# EAGLE design AK4493_Breakout_2 (EAGLE 9.6.2)
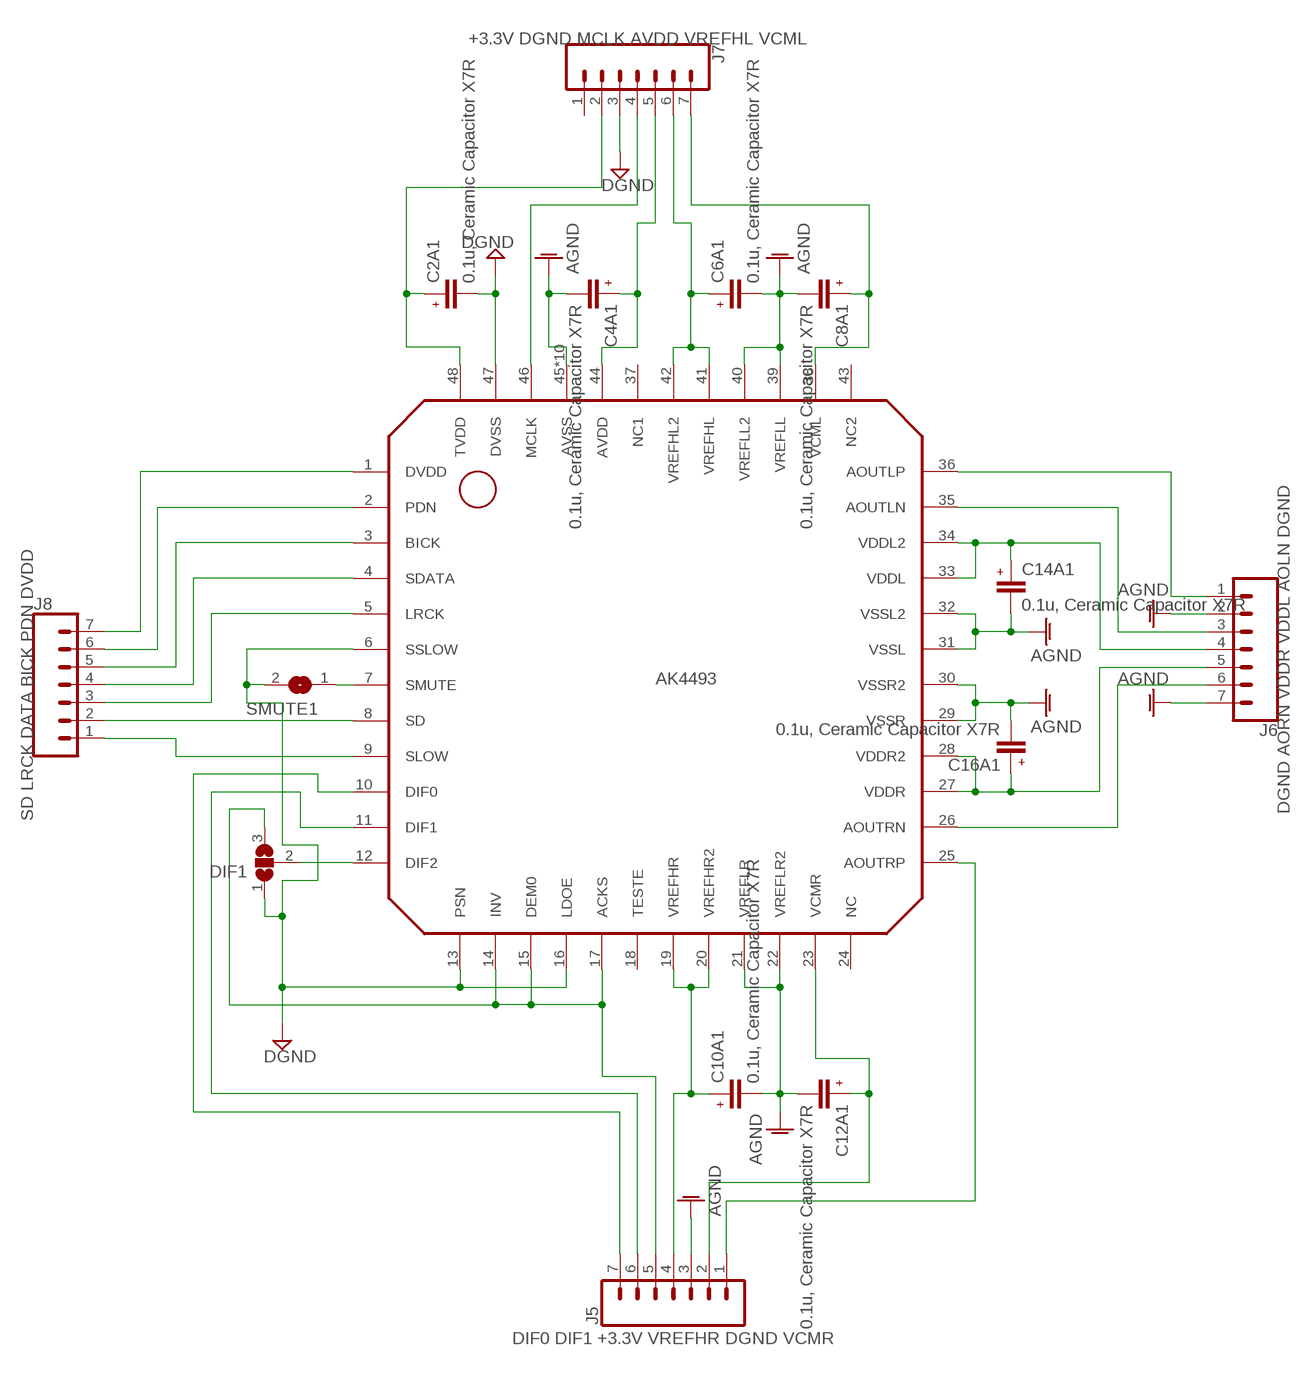
[diagram p0: schematic, sheet 1]

## Parts
C2A1  0.1u, Ceramic Capacitor X7R  C-POL-MLCCC0603K  [C0603K]
C4A1  0.1u, Ceramic Capacitor X7R  C-POL-MLCCC0603K  [C0603K]
C6A1  0.1u, Ceramic Capacitor X7R  C-POL-MLCCC0603K  [C0603K]
C8A1  0.1u, Ceramic Capacitor X7R  C-POL-MLCCC0603K  [C0603K]
C10A1  0.1u, Ceramic Capacitor X7R  C-POL-MLCCC0603K  [C0603K]
C12A1  0.1u, Ceramic Capacitor X7R  C-POL-MLCCC0603K  [C0603K]
C14A1  0.1u, Ceramic Capacitor X7R  C-POL-MLCCC0603K  [C0603K]
C16A1  0.1u, Ceramic Capacitor X7R  C-POL-MLCCC0603K  [C0603K]
DIF1  SJ2W  [SJ_2]
IC2  AK4493  [LQFP48_]
J5  CONN_07  [1X07]
J6  CONN_07  [1X07]
J7  CONN_07  [1X07]
J8  CONN_07  [1X07]
SMUTE1  SJ  [SJ]

## Nets
AGND: C4A1.2 C4A1.3 C6A1.2 C6A1.3 C8A1.2 C8A1.3 C10A1.2 C10A1.3 C12A1.2 C12A1.3 C14A1.2 C14A1.3 C16A1.2 C16A1.3 IC2.21(VREFLR) IC2.22(VREFLR2) IC2.29(VSSR) IC2.30(VSSR2) IC2.31(VSSL) IC2.32(VSSL2) IC2.39(VREFLL) IC2.40(VREFLL2) IC2.45(AVSS) IC2.P$1(AVSS) IC2.P$2(AVSS) IC2.P$4(AVSS) IC2.P$6(AVSS) IC2.P$8(AVSS) IC2.P$10(AVSS) IC2.P$17(AVSS) IC2.P$18(AVSS) IC2.P$25(AVSS) J5.3 J6.2 J6.7
DGND: C2A1.2 C2A1.3 DIF1.1 IC2.6(SSLOW) IC2.13(PSN) IC2.16(LDOE) IC2.47(DVSS) J7.3 SMUTE1.2
N$24 [L_Audio]: IC2.36(AOUTLP) J6.1
N$27 [L_Audio]: IC2.35(AOUTLN) J6.3
N$28 [R_Audio]: IC2.25(AOUTRP) J5.1
N$29 [R_Audio]: IC2.26(AOUTRN) J6.6
N$30: IC2.9(SLOW) J8.1
N$31: IC2.10(DIF0) J5.7
N$32: IC2.5(LRCK) J8.3
N$33: IC2.4(SDATA) J8.4
N$34: IC2.3(BICK) J8.5
N$35: IC2.46(MCLK) J7.4
N$36: IC2.1(DVDD) J8.7
N$37: C4A1.1 IC2.44(AVDD) J7.5
N$38: IC2.2(PDN) J8.6
N$39: C8A1.1 IC2.38(VCML) J7.7
N$40: C12A1.1 IC2.23(VCMR) J5.2
N$41: C6A1.1 IC2.41(VREFHL) IC2.42(VREFHL2) J7.6
N$42: DIF1.2 IC2.12(DIF2)
N$43: IC2.7(SMUTE) SMUTE1.1
N$44: IC2.8(SD) J8.2
N$45: IC2.11(DIF1) J5.6
N$46: C10A1.1 IC2.19(VREFHR) IC2.20(VREFHR2) J5.4
N$47: C14A1.1 IC2.33(VDDL) IC2.34(VDDL2) J6.4
N$48: C16A1.1 IC2.27(VDDR) IC2.28(VDDR2) J6.5
N$49: C2A1.1 IC2.48(TVDD) J7.2
N$50: DIF1.3 IC2.14(INV) IC2.15(DEM0) IC2.17(ACKS) J5.5
Unconnected: IC2.18(TESTE) IC2.24(NC) IC2.37(NC1) IC2.43(NC2) J7.1

## Notes on the sheet
- +3.3V DGND MCLK AVDD VREFHL VCML
- DGND AORN VDDR VDDL AOLN DGND
- SD LRCK DATA BICK PDN DVDD
- DIF0 DIF1 +3.3V VREFHR DGND VCMR

## Library data of the parts
C2A1 C4A1 C6A1 C8A1 C10A1 C12A1 C14A1 C16A1 = Dual Mono Amp Library:C-POL-MLCC: CAPACITOR, European symbol; SPICEPREFIX: C
DIF1 = Dual Mono Amp Library:SJ2W: SMD solder JUMPER
IC2 = Dual Mono Amp Library:AK4493: Quality Oriented 32-Bit 2ch DAC 32-Bit, 768 kHz with VELVET SOUND
J5-J8 = Dual Mono Amp Library:CONN_07: Multi connection point. Often used as Generic Header-pin footprint for 0.1 inch spaced/style header connections On any of the 0.1 inch spaced packages, you can populate with these: Break Away Headers - Straight <https://www.sparkfun.com/products/116> (PRT-00116) Break Away Male Headers - Right Angle <https://www.sparkfun.com/products/553> (PRT-00553) Female Headers <https://www.sparkfun.com/products/115> (PRT-00115) Break Away Headers - Machine Pin <https://www.sparkfun.com/products/117> (PRT-00117) Break Away Female Headers - Swiss Machine Pin <https://www.sparkfun.com/products/743> (PRT-00743) For SCREWTERMINALS and SPRING TERMINALS visit here: Screw Terimnals on SparkFun.com <https://www.sparkfun.com/search/results?term=Screw+Terminals> (5mm/3.5mm/2.54mm spacing) This device is also useful as a general connection point to wire up your design to another part of your project. Our various solder wires solder well into these plated through hole pads. Hook-Up Wire - Assortment (Stranded, 22 AWG) <https://www.sparkfun.com/products/11375> (PRT-11375) Hook-Up Wire - Assortment (Solid Core, 22 AWG) <https://www.sparkfun.com/products/11367> (PRT-11367) View the entire wire category on our website here <https://www.sparkfun.com/categories/141> Special notes: Molex polarized connector foot print use with SKU : PRT-08231 with associated crimp pins and housings. 1MM SMD Version SKU: PRT-10208 NOTES ON THE VARIANTS LOCK and LOCK_LONGPADS... This footprint was designed to help hold the alignment of a through-hole component (i.e. 6-pin header) while soldering it into place. You may notice that each hole has been shifted either up or down by 0.005 of an inch from it's more standard position (which is a perfectly straight line). This slight alteration caused the pins (the squares in the middle) to touch the edges of the holes. Because they are alternating, it causes a "brace" to hold the component in place. 0.005 has proven to be the perfect amount of "off-center" position when using our standard breakaway headers. Although looks a little odd when you look at the bare footprint, once you have a header in there, the alteration is very hard to notice. Also,if you push a header all the way into place, it is covered up entirely on the bottom side.; PROD_ID: Combine 8288+14485
SMUTE1 = Dual Mono Amp Library:SJ: SMD solder JUMPER

## Board
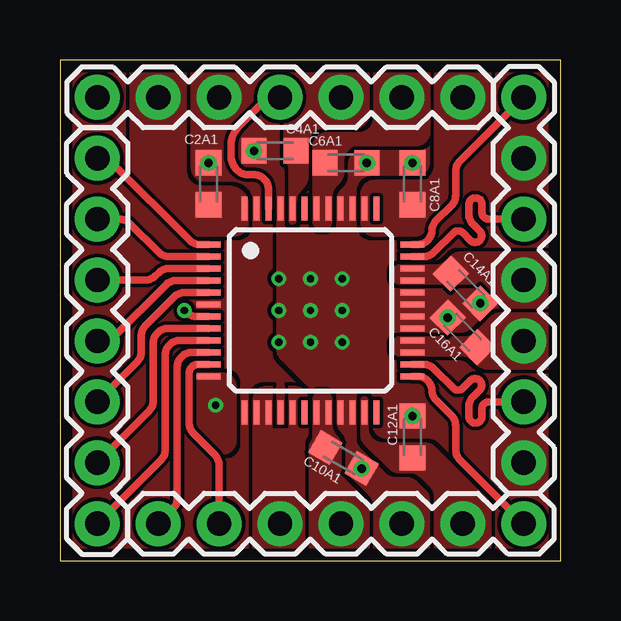
[diagram p1: board, top side]
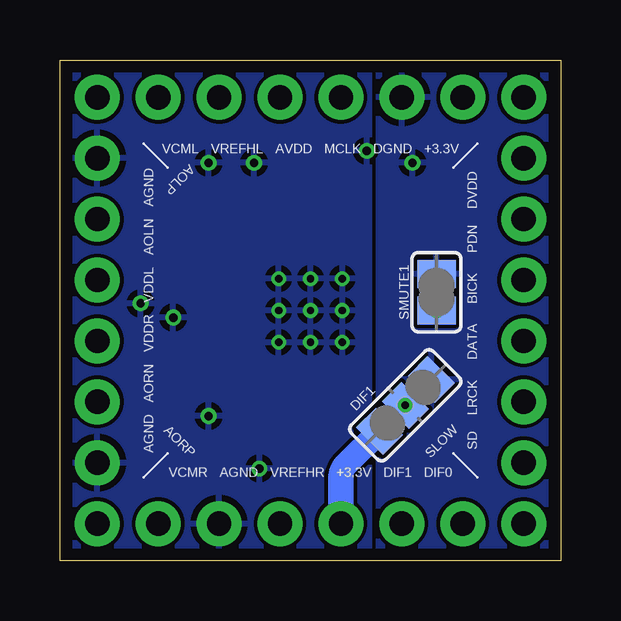
[diagram p2: board, bottom side, seen from below]

Size 20.89 x 20.89 mm. Coordinates in mm from the lower left corner, seen from the top.
Outline: 0,20.89 0,0 20.89,0 20.89,20.89 0,20.89
Copper layers (1*16): Top 0.035mm / dielectric 1.6mm / Bottom 0.035mm
Design rules "Elecrow_2-layer_PCB_eagle_rule": minimum track width 6mil, minimum drill 12mil, track to track 6mil, track to pad 6mil, pad to pad 6mil, via to via 8mil, smd to smd 0mil, copper to edge 20mil, drill to drill 10mil, minimum pad ring 6mil, minimum via ring 6mil, stop-mask expansion 0mil, vias tented up to drill 100mil, thermal gap 10mil

### Footprints (pad centres in the part's own frame; a part is rotated, then mirrored left to right if it is on the bottom)
C0603K = smd 1.05 x 1.08: 1 -0.875,0; 2 0.875,0 | drill 0.35: 3 0.875,0
SJ_2 = smd 1.168 x 1.6: 1 -1.524,0; 2 0,0; 3 1.524,0
LQFP48_ = smd 0.25 x 1: 1 -2.75,-4.25; 2 -2.25,-4.25; 3 -1.75,-4.25; 4 -1.25,-4.25; 5 -0.75,-4.25; 6 -0.25,-4.25; 7 0.25,-4.25; 8 0.75,-4.25; 9 1.25,-4.25; 10 1.75,-4.25; 11 2.25,-4.25; 12 2.75,-4.25; 25 2.75,4.25; 26 2.25,4.25; 27 1.75,4.25; 28 1.25,4.25; 29 0.75,4.25; 30 0.25,4.25; 31 -0.25,4.25; 32 -0.75,4.25; 33 -1.25,4.25; 34 -1.75,4.25; 35 -2.25,4.25; 36 -2.75,4.25 | smd 1 x 0.25: 13 4.25,-2.75; 14 4.25,-2.25; 15 4.25,-1.75; 16 4.25,-1.25; 17 4.25,-0.75; 18 4.25,-0.25; 19 4.25,0.25; 20 4.25,0.75; 21 4.25,1.25; 22 4.25,1.75; 23 4.25,2.25; 24 4.25,2.75; 37 -4.25,2.75; 38 -4.25,2.25; 39 -4.25,1.75; 40 -4.25,1.25; 41 -4.25,0.75; 42 -4.25,0.25; 43 -4.25,-0.25; 44 -4.25,-0.75; 45 -4.25,-1.25; 46 -4.25,-1.75; 47 -4.25,-2.25; 48 -4.25,-2.75 | drill 0.305 pad 0.61: P$1 0,0; P$2 -1.327,0; P$4 1.327,0; P$6 0,1.327; P$8 0,-1.327; P$10 -1.327,-1.327; P$17 1.327,-1.327; P$18 1.327,1.327; P$25 -1.327,1.327
1X07 = drill 1.016 pad 1.88: 1 0,0; 2 2.54,0; 3 5.08,0; 4 7.62,0; 5 10.16,0; 6 12.7,0; 7 15.24,0
SJ = smd 1.168 x 1.6: 1 -0.762,0; 2 0.762,0

### Placement (x,y rotation side)
C2A1  6.2,15.73 90 top
C4A1  8.97,17.1 180 top
C6A1  11.92,16.6 0 top
C8A1  14.7,15.73 90 top
C10A1  11.82,4.29 330 top
C12A1  14.7,5.17 90 top
C14A1  16.91,11.36 315 top
C16A1  16.79,9.53 135 top
DIF1  6.49,6.49 225 bottom
IC2  10.45,10.45 270 top
J5  19.34,1.56 180 top
J6  19.34,19.34 270 top
J7  1.56,19.34 0 top
J8  1.56,1.56 90 top
SMUTE1  5.19,11.21 90 bottom

### Tracks (layer width: path | path; a pad name or v marks a point on that pad's centre or on a via)
AGND
  pour Top (rank 5, no thermals): 9.02,20.89 20.28,20.89 arc-90 20.89,20.28 20.89,0.61 arc-90 20.28,0 11.13,0 arc-90 10.52,0.61 10.52,6.82 arc45 10.34,7.26 9.2,8.4 arc-45 9.02,8.83 9.02,15.5 arc90 8.41,16.11 7.89,16.11 arc-90 7.14,16.86 7.14,17.38 arc-45 7.43,18.08 8.45,19.1 arc-45 9.02,19.34
  pour Bottom: 8.59,20.89 20.28,20.89 arc-90 20.89,20.28 20.89,0.61 arc-90 20.28,0 8.59,0 arc-90 7.98,0.61 7.98,20.28 arc-90
DGND
  pour Top (no thermals): 9.02,7.59 9.02,5.69 9.37,5.69 9.37,7.59
  pour Top (rank 6, no thermals): 20.89,0 0.61,0 arc-90 0,0.61 0,20.28 arc-90 0.61,20.89 20.89,20.89
  pour Bottom (rank 6): 0.61,20.89 20.28,20.89 arc-90 20.89,20.28 20.89,0.61 arc-90 20.28,0 0.61,0 arc-90 0,0.61 0,20.28 arc-90
N$24
  Top 0.305: IC2.36 14.91,13.2 arc90 15.52,13.81 arc-45 15.67,14.17 16.32,14.82 arc45 16.5,15.26 16.5,16.25 arc-45 16.68,16.68 J6.1
N$27
  Top 0.305: IC2.35 15.17,12.7 arc45 15.6,12.88 16.41,13.69 arc-90 16.8,13.69 17.12,13.37 arc180 17.51,13.76 17.23,14.03 arc-45 17.05,14.46 17.05,14.87 arc-180 17.6,14.87 17.6,14.53 arc90 17.88,14.26 J6.3
N$28
  Top 0.305: IC2.25 14.91,7.7 arc-90 15.52,7.09 arc45 15.67,6.73 16.32,6.07 arc-45 16.5,5.64 16.5,4.64 arc45 16.68,4.21 J5.1
N$29
  Top 0.305: IC2.26 15.17,8.2 arc-45 15.6,8.02 16.41,7.21 arc90 16.8,7.21 17.12,7.53 arc-180 17.51,7.14 17.23,6.86 arc45 17.05,6.43 17.05,6.03 arc180 17.6,6.03 17.6,6.36 arc-90 17.88,6.64 J6.6
N$30
  Top 0.305: IC2.9 5,9.2 arc90 4.39,8.59 4.39,4.64 arc-45 4.21,4.21 J8.1
N$31
  Top 0.305: IC2.10 5.5,8.7 arc90 4.89,8.09 4.89,2.6 arc-45 4.71,2.17 J5.7
N$32
  Top 0.305: IC2.5 5.2,11.2 arc45 4.77,11.02 3.57,9.82 arc45 3.39,9.39 3.39,8.72 arc-45 3.21,8.29 J8.3
N$33
  Top 0.305: IC2.4 4.85,11.7 arc45 4.42,11.52 2.26,9.36 arc-45 1.82,9.18 J8.4
N$34
  Top 0.305: IC2.3 4.54,12.2 arc45 4.11,12.02 3.99,11.9 arc-45 3.55,11.72 J8.5
N$35
  Top 0.305: J7.4 9.1,19.34 arc45 8.39,19.04 7.43,18.09 arc45 7.14,17.38 7.14,16.86 arc90 7.89,16.11 8.09,16.11 arc-90 8.7,15.5 IC2.46
N$36
  Top 0.305: IC2.1 5.84,13.2 arc-45 5.41,13.38 2.17,16.62 arc45 1.73,16.8 J8.7
N$37
  pour Top (no thermals): 12.3,20.89 9.93,20.89 arc90 9.32,20.28 9.32,16.84 arc45 9.41,16.62 9.43,16.6 arc-45 9.52,16.38 9.52,14.2 arc180 9.87,14.2 9.87,14.85 arc-45 10.16,15.56 arc45 10.37,16.06 10.37,17.42 arc-90 10.98,18.03 12.3,18.03 arc90 12.91,18.64 12.91,20.28 arc90
N$38
  Top 0.305: IC2.2 4.54,12.7 arc-45 4.11,12.88 2.91,14.08 arc45 2.47,14.26 J8.6
N$39
  pour Top (no thermals): 15.6,16.51 15.6,20.28 arc-90 16.21,20.89 17.38,20.89 arc-90 17.99,20.28 17.99,18.24 arc-45 17.81,17.81 16.68,16.68 arc45 16.5,16.25 16.5,15.25 arc-45 16.32,14.82 15.2,13.7 arc-45 14.77,13.52 13.13,13.52 arc-90 12.52,14.13 12.52,15.29 arc-90 13.13,15.9 14.99,15.9 arc90
N$40
  pour Top (no thermals): 15.04,3.48 15.42,3.09 arc-45 15.6,2.66 15.6,0.61 arc90 16.21,0 17.38,0 arc90 17.99,0.61 17.99,2.18 arc45 17.81,2.61 15.66,4.76 arc45 15.23,4.94 13.48,4.94 arc-90 12.87,5.55 12.87,6.69 arc180 12.52,6.69 12.52,5.28 arc45 12.7,4.85 13.71,3.83 arc45 14.14,3.66 14.61,3.66 arc-45
N$41
  pour Top (no thermals): 13.06,18.49 13.06,20.28 arc-90 13.67,20.89 14.84,20.89 arc-90 15.45,20.28 15.45,17.91 arc-90 14.84,17.3 12.46,17.3 arc90 11.85,16.69 11.85,16.18 arc-45 11.67,15.75 11.55,15.63 arc45 11.37,15.2 11.37,14.2 arc-180 10.52,14.2 10.52,17.27 arc-90 11.13,17.88 12.45,17.88 arc90
N$42  (via drill 0.3)
  other vias: 6.49,6.49
  pour Top (no thermals): 7.37,5.04 7.37,7.26 arc90 6.76,7.87 5.39,7.87 5.39,5.68 arc45 5.57,5.25 6.21,4.6 arc45 6.64,4.43 6.76,4.43 arc90
N$43  (via drill 0.3)
  Top 0.305: IC2.7 5.7,10.2 arc-45 5.26,10.38 SMUTE1.1
  other vias: 5.19,10.45
N$44
  Top 0.305: IC2.8 4.5,9.7 arc90 3.89,9.09 3.89,6.68 arc-45 3.71,6.25 J8.2
N$45
  Top 0.305: IC2.11 5.75,8.2 arc90 5.39,7.84 5.39,5.75 arc45 5.57,5.31 6.46,4.43 arc-45 6.64,3.99 J5.6
N$46
  pour Top (no thermals): 10.52,6.69 10.52,5.15 arc-45 10.45,4.97 arc45 10.39,4.83 10.39,0.61 arc90 11,0 12.3,0 arc90 12.91,0.61 12.91,2.14 arc45 12.73,2.57 11.92,3.38 arc-45 11.75,3.81 11.75,4.79 arc45 11.57,5.22 11.55,5.23 arc-45 11.37,5.67 11.37,6.69 arc180
N$47
  pour Top (no thermals): 14.2,12.37 arc180 14.2,11.52 17.39,11.52 arc-45 17.82,11.34 18.46,10.7 arc45 18.89,10.52 20.28,10.52 arc90 20.89,11.13 20.89,12.3 arc90 20.28,12.91 16.72,12.91 arc45 16.29,12.73 16.11,12.55 arc-45 15.68,12.37
N$48
  pour Top (no thermals): 14.2,8.52 arc-180 14.2,9.37 16.88,9.37 arc45 17.31,9.55 17.95,10.19 arc-45 18.38,10.37 20.28,10.37 arc-90 20.89,9.76 20.89,8.59 arc-90 20.28,7.98 17.81,7.98 arc-45 17.38,8.16 17.2,8.34 arc45 16.77,8.52
N$49
  pour Top (no thermals): 4.68,20.89 3.51,20.89 arc90 2.9,20.28 2.9,16.13 arc45 3.13,15.58 5.01,13.7 arc45 5.44,13.52 7.26,13.52 arc90 7.87,14.13 7.87,14.85 arc90 7.07,15.65 5.9,15.65 arc-90 5.29,16.26 5.29,20.28 arc90
N$50
  Bottom 1.016: 9.18,3.55 arc45 9,3.99 DIF1.3
  Bottom 1.06: J5.5 9.18,3.55
  pour Top (rank 2, no thermals): 10.37,0.61 10.37,6.69 arc90 9.76,7.3 8.63,7.3 arc90 8.02,6.69 8.02,0.61 arc90 8.63,0 9.76,0 arc90

### Text on the board
bNames: VCML VREFHL AVDD MCLK DGND +3.3V | AOLP | SD LRCK DATA BICK PDN DVDD | AGND AORN VDDR VDDL AOLN AGND | SLOW | AORP | VCMR AGND VREFHR +3.3V DIF1 DIF0